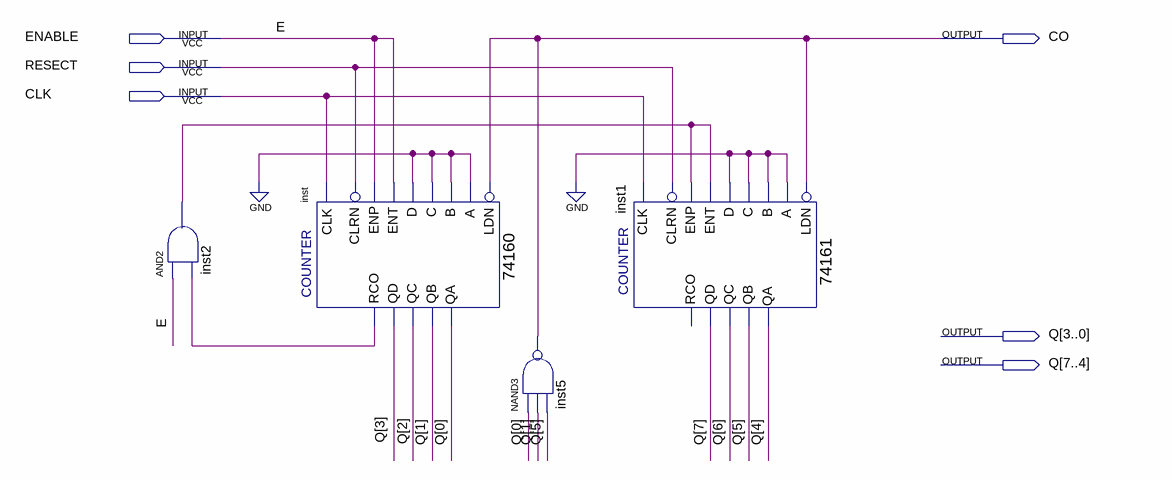
[diagram p0: schematic sheet]
// Quartus schematic Counter24.bdf as structural Verilog: 4 symbols, 6 pins
module Counter24 (
  input  ENABLE,
  input  RESECT,
  input  CLK,
  output CO,
  output [7:0] Q
);

  wire inst2_out, inst_rco;

  and inst2 (inst2_out, ENABLE, inst_rco);
  \74160  inst (
    .CLK(CLK), .ENT(ENABLE), .A(1'b0), .B(1'b0), .C(1'b0), .D(1'b0), .LDN(CO), .ENP(ENABLE), .CLRN(RESECT),
    .QD(Q[3]), .QA(Q[0]), .QB(Q[1]), .QC(Q[2]), .RCO(inst_rco));
  nand inst5 (CO, Q[0], Q[1], Q[5]);
  \74161  inst1 (
    .CLRN(RESECT), .CLK(CLK), .ENP(inst2_out), .LDN(CO), .A(1'b0), .D(1'b0), .ENT(inst2_out), .B(1'b0),
    .C(1'b0), .QD(Q[7]), .QC(Q[6]), .QB(Q[5]), .QA(Q[4]));  // open: RCO

  // Other names for the same wires on the sheet: E = ENABLE
endmodule
